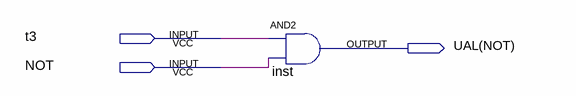
[diagram p0: schematic sheet]
// Quartus schematic UAL(NOT).bdf as structural Verilog: 1 symbols, 3 pins
module \UAL(NOT)  (
  input  t3,
  input  NOT,
  output \UAL(NOT) 
);

  and inst (\UAL(NOT) , t3, NOT);
endmodule
